# EAGLE design gt-jtx-m32-ver1.0 (EAGLE 7.5.0)
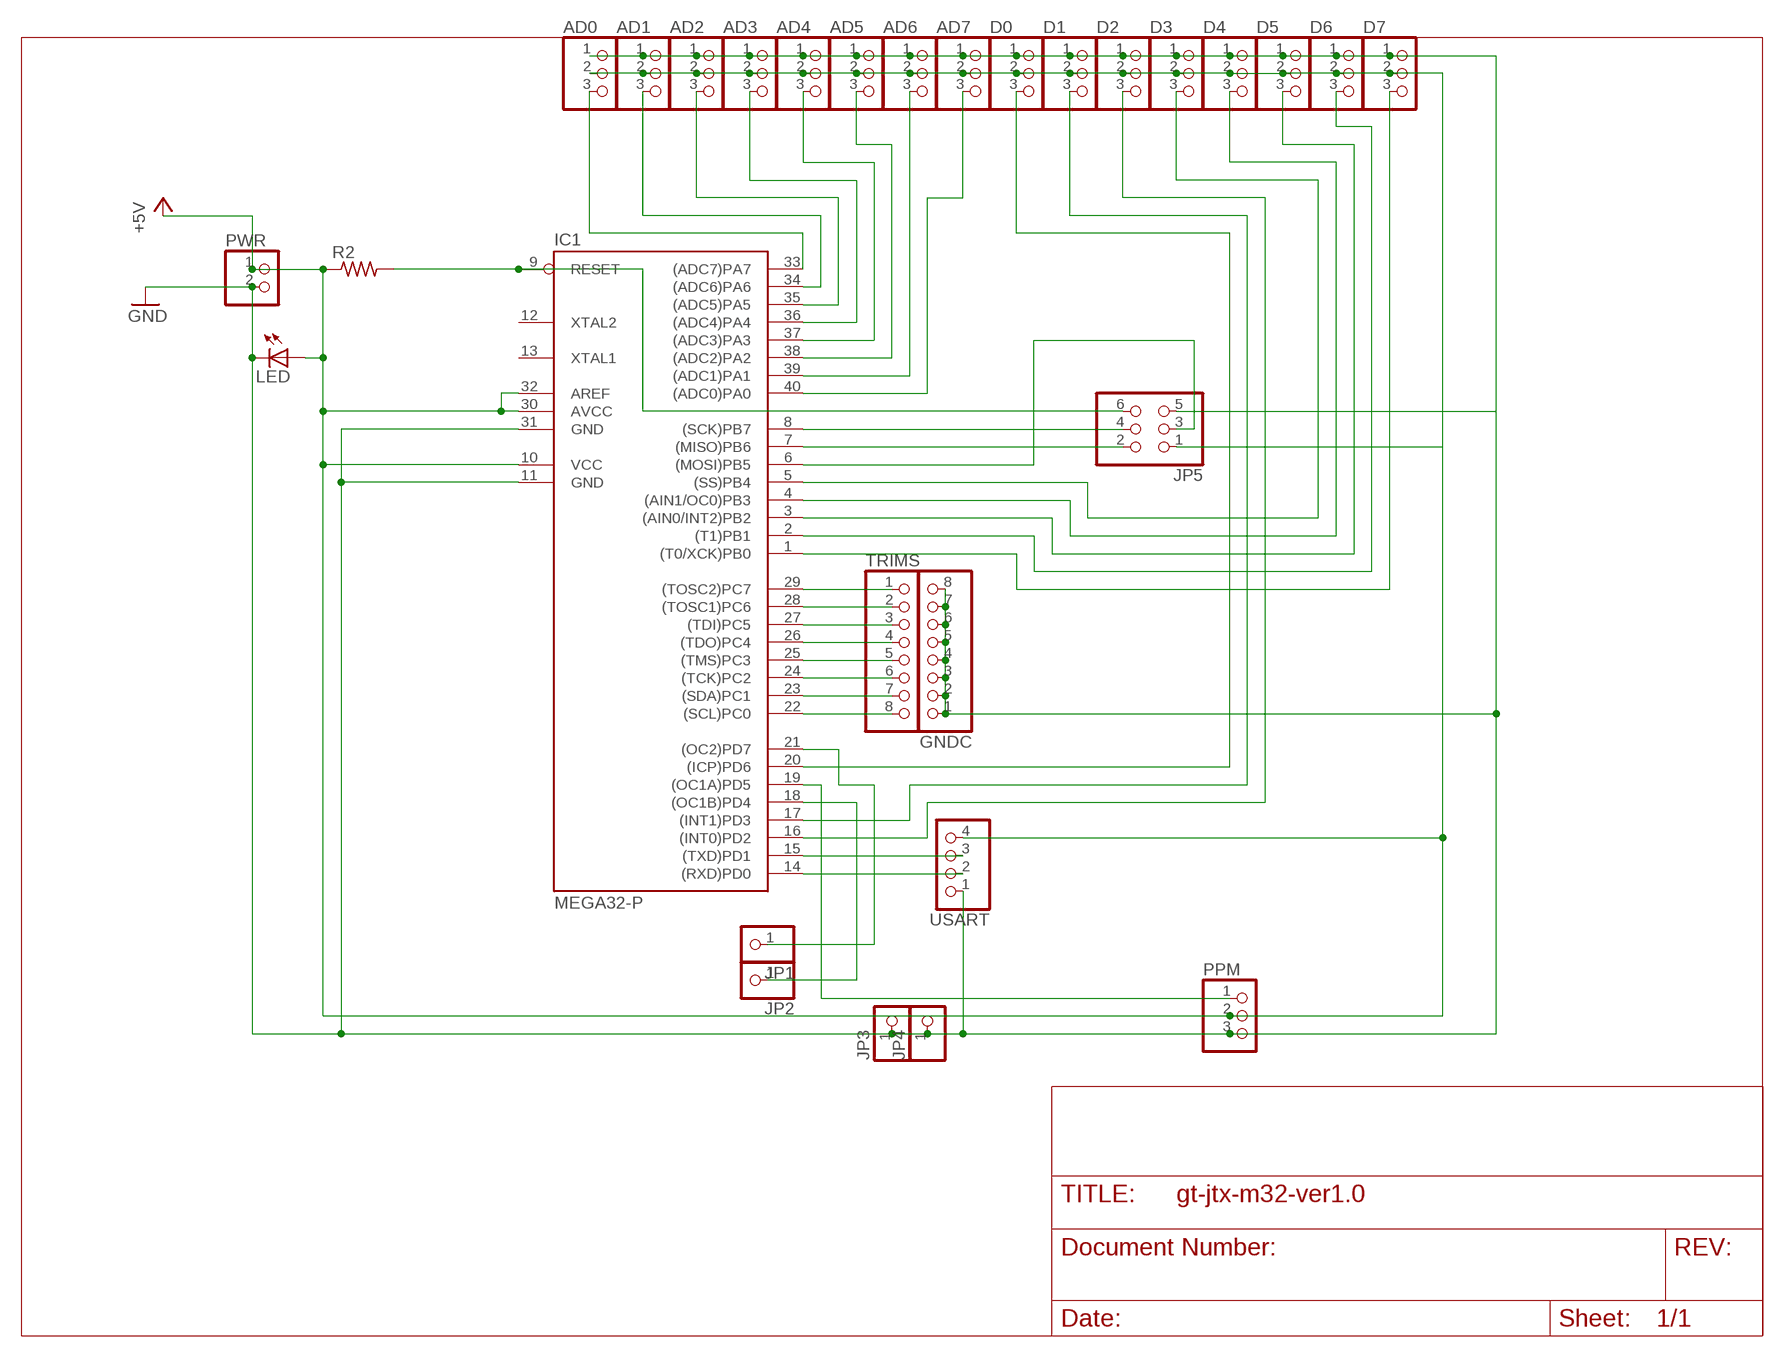
[diagram p0: schematic, sheet 1]

## Parts
AD0  PINHD-1X3  [1X03]
AD1  PINHD-1X3  [1X03]
AD2  PINHD-1X3  [1X03]
AD3  PINHD-1X3  [1X03]
AD4  PINHD-1X3  [1X03]
AD5  PINHD-1X3  [1X03]
AD6  PINHD-1X3  [1X03]
AD7  PINHD-1X3  [1X03]
D0  PINHD-1X3  [1X03]
D1  PINHD-1X3  [1X03]
D2  PINHD-1X3  [1X03]
D3  PINHD-1X3  [1X03]
D4  PINHD-1X3  [1X03]
D5  PINHD-1X3  [1X03]
D6  PINHD-1X3  [1X03]
D7  PINHD-1X3  [1X03]
GNDC  PINHD-1X8  [1X08]
IC1  MEGA32-P  [DIL40]
JP1  PINHD-1X1  [1X01]
JP2  PINHD-1X1  [1X01]
JP3  PINHD-1X1  [1X01]
JP4  PINHD-1X1  [1X01]
JP5  PINHD-2X3  [2X03]
LED  LED5MM  [LED5MM]
PPM  PINHD-1X3  [1X03]
PWR  PINHD-1X2  [1X02]
R2  R-US_0204/2V  [0204V]
TRIMS  PINHD-1X8  [1X08]
USART  PINHD-1X4  [1X04]

## Nets
+5V: AD0.2 AD1.2 AD2.2 AD3.2 AD4.2 AD5.2 AD6.2 AD7.2 D0.2 D1.2 D2.2 D3.2 D4.2 D5.2 D6.2 D7.2 IC1.10(VCC) IC1.30(AVCC) IC1.32(AREF) JP5.1 LED.A PPM.2 PWR.1 R2.1 USART.4
GND: AD0.1 AD1.1 AD2.1 AD3.1 AD4.1 AD5.1 AD6.1 AD7.1 D0.1 D1.1 D2.1 D3.1 D4.1 D5.1 D6.1 D7.1 GNDC.1 GNDC.2 GNDC.3 GNDC.4 GNDC.5 GNDC.6 GNDC.7 GNDC.8 IC1.11(GND) IC1.31(GND) JP3.1 JP4.1 JP5.5 LED.K(C) PPM.3 PWR.2 USART.1
N$1: AD7.3 IC1.40((ADC0)PA0)
N$2: AD6.3 IC1.39((ADC1)PA1)
N$3: AD5.3 IC1.38((ADC2)PA2)
N$4: AD4.3 IC1.37((ADC3)PA3)
N$5: IC1.14((RXD)PD0) USART.2
N$6: IC1.15((TXD)PD1) USART.3
N$7: IC1.29((TOSC2)PC7) TRIMS.1
N$8: AD3.3 IC1.36((ADC4)PA4)
N$9: IC1.9(RESET) JP5.6 R2.2
N$10: AD2.3 IC1.35((ADC5)PA5)
N$11: AD1.3 IC1.34((ADC6)PA6)
N$12: IC1.6((MOSI)PB5) JP5.3
N$13: IC1.7((MISO)PB6) JP5.2
N$14: IC1.8((SCK)PB7) JP5.4
N$15: IC1.19((OC1A)PD5) PPM.1
N$16: IC1.28((TOSC1)PC6) TRIMS.2
N$17: AD0.3 IC1.33((ADC7)PA7)
N$18: IC1.27((TDI)PC5) TRIMS.3
N$19: IC1.26((TDO)PC4) TRIMS.4
N$20: IC1.25((TMS)PC3) TRIMS.5
N$21: IC1.24((TCK)PC2) TRIMS.6
N$22: IC1.23((SDA)PC1) TRIMS.7
N$23: IC1.22((SCL)PC0) TRIMS.8
N$24: D3.3 IC1.5((SS)PB4)
N$25: D4.3 IC1.4((AIN1/OC0)PB3)
N$26: D5.3 IC1.3((AIN0/INT2)PB2)
N$27: D6.3 IC1.2((T1)PB1)
N$28: D7.3 IC1.1((T0/XCK)PB0)
N$29: D2.3 IC1.16((INT0)PD2)
N$30: D1.3 IC1.17((INT1)PD3)
N$31: D0.3 IC1.20((ICP)PD6)
N$32: IC1.18((OC1B)PD4) JP2.1
N$33: IC1.21((OC2)PD7) JP1.1
Unconnected: IC1.12(XTAL2) IC1.13(XTAL1)

## Library data of the parts
AD0 AD1-AD7 D0 D1-D7 PPM = pinhead:PINHD-1X3: PIN HEADER
GNDC TRIMS = pinhead:PINHD-1X8: PIN HEADER
IC1 = atmel:MEGA32-P: MICROCONTROLLER 32 Kbytes FLASH 2 Kbytes SRAM 1 Kbytes EEPROM USART 8-channel 10 bit ADC Source: www.atmel.com .. doc2503.pdf; MPN: ATMEGA32-16PU; OC_FARNELL: 1661729; OC_NEWARK: 51P1794
JP1-JP4 = pinhead:PINHD-1X1: PIN HEADER
JP5 = pinhead:PINHD-2X3: PIN HEADER
LED = led:LED: LED OSRAM: - CHIPLED LG R971, LG N971, LY N971, LG Q971, LY Q971, LO R971, LY R971 LH N974, LH R974 LS Q976, LO Q976, LY Q976 LO Q996 - Hyper CHIPLED LW Q18S LB Q993, LB Q99A, LB R99A - SideLED LS A670, LO A670, LY A670, LG A670, LP A670 LB A673, LV A673, LT A673, LW A673 LH A674 LY A675 LS A676, LA A676, LO A676, LY A676, LW A676 LS A679, LY A679, LG A679 - Hyper Micro SIDELED® LS Y876, LA Y876, LO Y876, LY Y876 LT Y87S - SmartLED LW L88C, LW L88S LB L89C, LB L89S, LG L890 LS L89K, LO L89K, LY L89K LS L896, LA L896, LO L896, LY L896 - TOPLED LS T670, LO T670, LY T670, LG T670, LP T670 LSG T670, LSP T670, LSY T670, LOP T670, LYG T670 LG T671, LOG T671, LSG T671 LB T673, LV T673, LT T673, LW T673 LH T674 LS T676, LA T676, LO T676, LY T676, LB T676, LH T676, LSB T676, LW T676 LB T67C, LV T67C, LT T67C, LS T67K, LO T67K, LY T67K, LW E67C LS E67B, LA E67B, LO E67B, LY E67B, LB E67C, LV E67C, LT E67C LW T67C LS T679, LY T679, LG T679 LS T770, LO T770, LY T770, LG T770, LP T770 LB T773, LV T773, LT T773, LW T773 LH T774 LS E675, LA E675, LY E675, LS T675 LS T776, LA T776, LO T776, LY T776, LB T776 LHGB T686 LT T68C, LB T68C - Hyper Mini TOPLED® LB M676 - Mini TOPLED Santana® LG M470 LS M47K, LO M47K, LY M47K Source: http://www.osram.convergy.de LUXEON: - LUMILED® LXK2-PW12-R00, LXK2-PW12-S00, LXK2-PW14-U00, LXK2-PW14-V00 LXK2-PM12-R00, LXK2-PM12-S00, LXK2-PM14-U00 LXK2-PE12-Q00, LXK2-PE12-R00, LXK2-PE12-S00, LXK2-PE14-T00, LXK2-PE14-U00 LXK2-PB12-K00, LXK2-PB12-L00, LXK2-PB12-M00, LXK2-PB14-N00, LXK2-PB14-P00, LXK2-PB14-Q00 LXK2-PR12-L00, LXK2-PR12-M00, LXK2-PR14-Q00, LXK2-PR14-R00 LXK2-PD12-Q00, LXK2-PD12-R00, LXK2-PD12-S00 LXK2-PH12-R00, LXK2-PH12-S00 LXK2-PL12-P00, LXK2-PL12-Q00, LXK2-PL12-R00 Source: www.luxeon.com KINGBRIGHT: KA-3528ASYC Source: www.kingbright.com
PWR = pinhead:PINHD-1X2: PIN HEADER
R2 = resistor:R-US_: RESISTOR, American symbol
USART = pinhead:PINHD-1X4: PIN HEADER

## Board
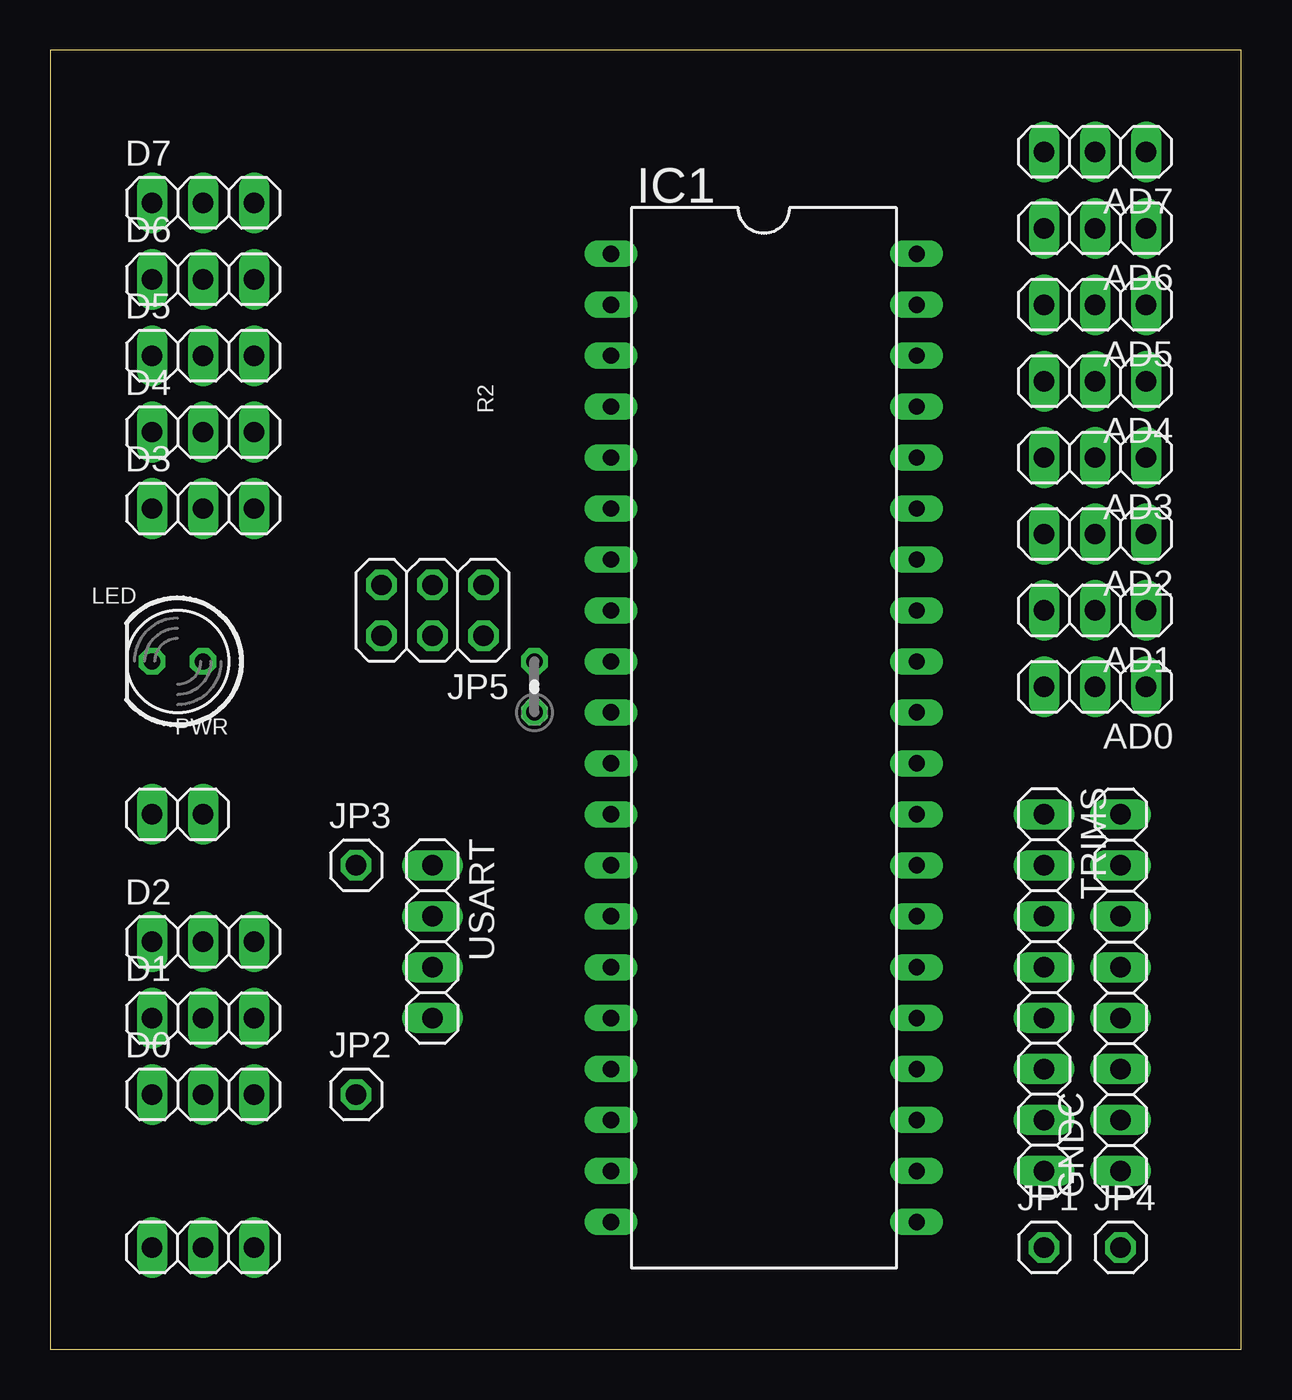
[diagram p1: board, top side]
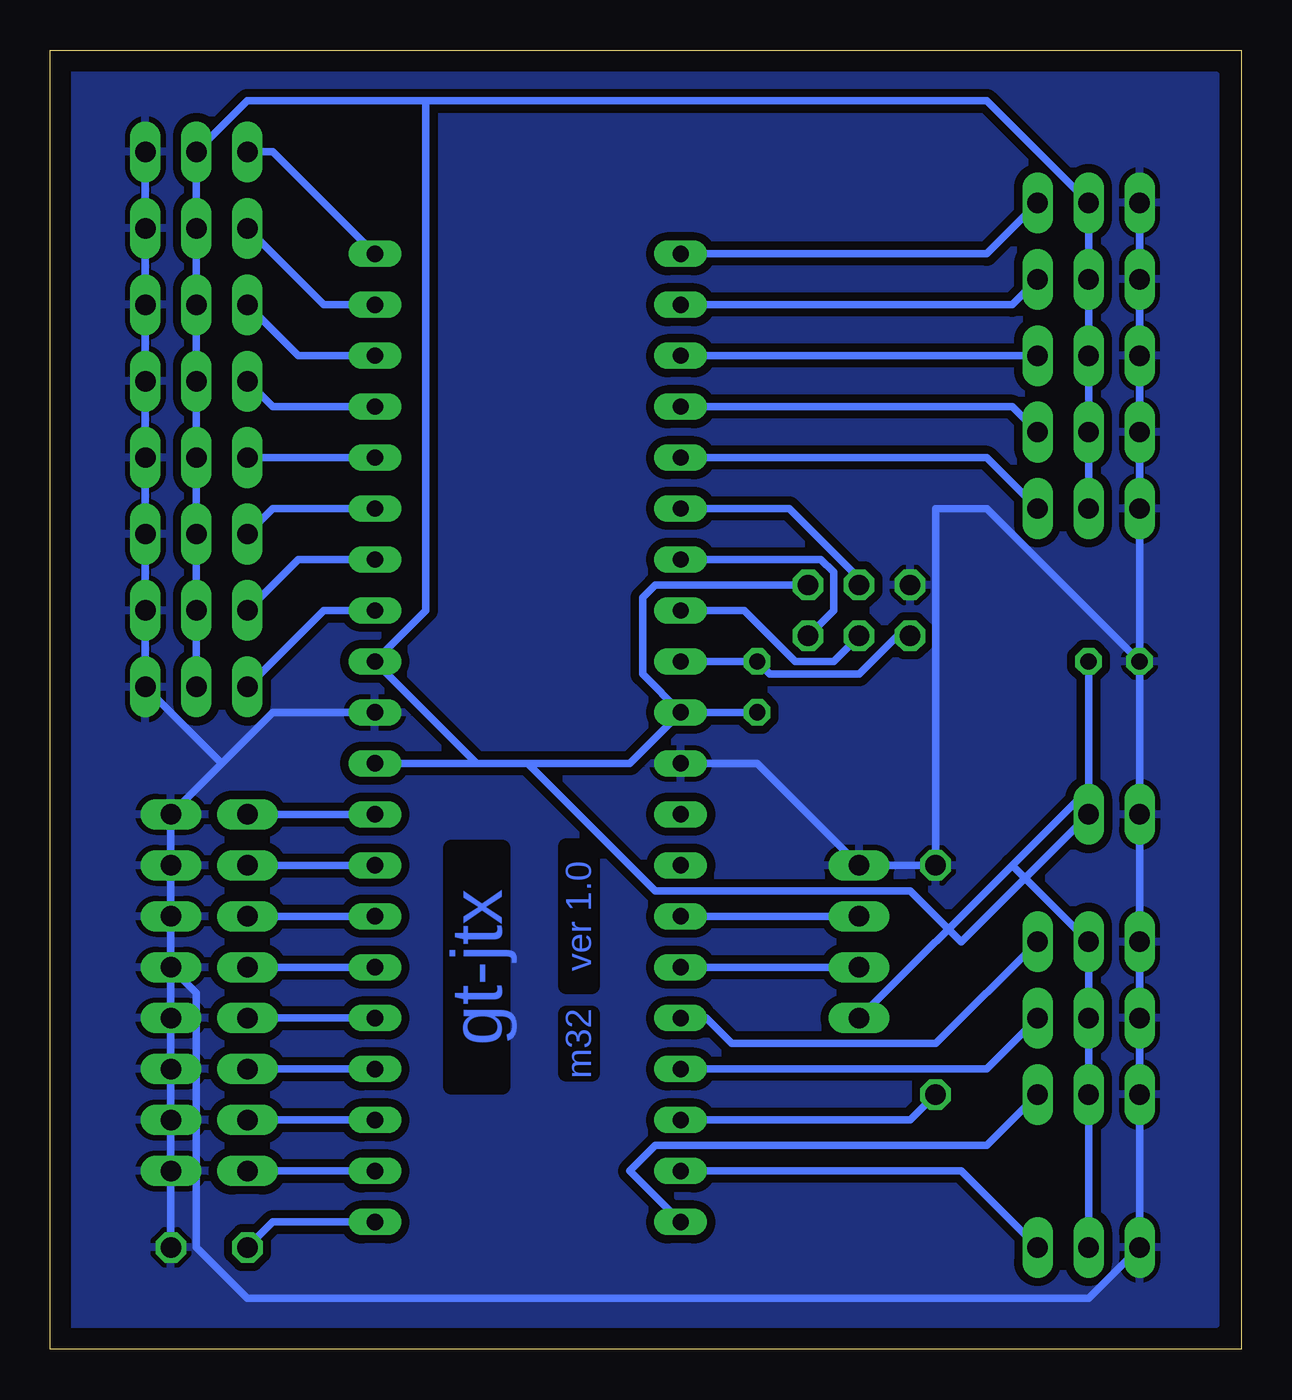
[diagram p2: board, bottom side, seen from below]

Size 59.36 x 64.76 mm. Coordinates in mm from the lower left corner, seen from the top.
Outline: 0,0 59.36,0 59.36,64.76 0,64.76 0,0
Copper layers (1*16): Top 0.035mm / dielectric 1.5mm / Bottom 0.035mm
Design rules "default *": minimum track width 15mil, minimum drill 24mil, track to track 10mil, track to pad 10mil, pad to pad 10mil, via to via 10mil, smd to smd 8mil, copper to edge 40mil, drill to drill 8mil, minimum pad ring 10mil, minimum via ring 8mil, stop-mask expansion 4mil, vias tented up to drill 0mil, thermal gap 10mil

### Footprints (pad centres in the part's own frame; a part is rotated, then mirrored left to right if it is on the bottom)
1X03 = drill 1.016 long: 1 -2.54,0; 2 0,0; 3 2.54,0
1X08 = drill 1.016 long: 1 -8.89,0; 2 -6.35,0; 3 -3.81,0; 4 -1.27,0; 5 1.27,0; 6 3.81,0; 7 6.35,0; 8 8.89,0
DIL40 = drill 0.813 long: 1 -24.13,-7.62; 2 -21.59,-7.62; 3 -19.05,-7.62; 4 -16.51,-7.62; 5 -13.97,-7.62; 6 -11.43,-7.62; 7 -8.89,-7.62; 8 -6.35,-7.62; 9 -3.81,-7.62; 10 -1.27,-7.62; 11 1.27,-7.62; 12 3.81,-7.62; 13 6.35,-7.62; 14 8.89,-7.62; 15 11.43,-7.62; 16 13.97,-7.62; 17 16.51,-7.62; 18 19.05,-7.62; 19 21.59,-7.62; 20 24.13,-7.62; 21 24.13,7.62; 22 21.59,7.62; 23 19.05,7.62; 24 16.51,7.62; 25 13.97,7.62; 26 11.43,7.62; 27 8.89,7.62; 28 6.35,7.62; 29 3.81,7.62; 30 1.27,7.62; 31 -1.27,7.62; 32 -3.81,7.62; 33 -6.35,7.62; 34 -8.89,7.62; 35 -11.43,7.62; 36 -13.97,7.62; 37 -16.51,7.62; 38 -19.05,7.62; 39 -21.59,7.62; 40 -24.13,7.62
1X01 = drill 1.016 octagon: 1 0,0
2X03 = drill 1.016 octagon: 1 -2.54,-1.27; 2 -2.54,1.27; 3 0,-1.27; 4 0,1.27; 5 2.54,-1.27; 6 2.54,1.27
LED5MM = drill 0.813 octagon: A -1.27,0; K 1.27,0
1X02 = drill 1.016 long: 1 -1.27,0; 2 1.27,0
0204V = drill 0.813 octagon: 1 -1.27,0; 2 1.27,0
1X04 = drill 1.016 long: 1 -3.81,0; 2 -1.27,0; 3 1.27,0; 4 3.81,0

### Placement (x,y rotation side)
AD0  52.07,33.02 180 top
AD1  52.07,36.83 180 top
AD2  52.07,40.64 180 top
AD3  52.07,44.45 180 top
AD4  52.07,48.26 180 top
AD5  52.07,52.07 180 top
AD6  52.07,55.88 180 top
AD7  52.07,59.69 180 top
D0  7.62,12.7 0 top
D1  7.62,16.51 0 top
D2  7.62,20.32 0 top
D3  7.62,41.91 0 top
D4  7.62,45.72 0 top
D5  7.62,49.53 0 top
D6  7.62,53.34 0 top
D7  7.62,57.15 0 top
GNDC  53.34,17.78 90 top
IC1  35.56,30.48 270 top
JP1  49.53,5.08 0 top
JP2  15.24,12.7 0 top
JP3  15.24,24.13 0 top
JP4  53.34,5.08 0 top
JP5  19.05,36.83 180 top
LED  6.35,34.29 180 top
PPM  7.62,5.08 180 top
PWR  6.35,26.67 180 top
R2  24.13,33.02 90 top
TRIMS  49.53,17.78 270 top
USART  19.05,20.32 270 top

### Tracks (layer width: path | path; a pad name or v marks a point on that pad's centre or on a via)
+5V
  Bottom 0.381: PPM.2 D0.2 D1.2 D2.2 11.43,24.13 | 7.62,27.94 LED.A | 7.62,27.94 11.43,24.13 | 11.43,24.13 USART.4 | 7.62,27.94 PWR.1 13.97,20.32 16.51,22.86 29.21,22.86 35.56,29.21 | 35.56,29.21 30.48,29.21 IC1.10 | 35.56,29.21 38.1,29.21 | 38.1,29.21 IC1.30 | 38.1,29.21 IC1.32 40.64,36.83 40.64,62.23 | D3.2 D4.2 D5.2 D6.2 D7.2 12.7,62.23 40.64,62.23 | AD0.2 AD1.2 AD2.2 AD3.2 AD4.2 AD5.2 AD6.2 AD7.2 49.53,62.23 40.64,62.23 | IC1.10 R2.1 | JP5.1 29.21,38.1 29.84,37.47 29.84,33.66 IC1.10
GND
  Bottom 0.381: AD7.1 AD6.1 AD5.1 AD4.1 AD3.1 AD2.1 AD1.1 AD0.1 50.8,29.21 | IC1.31 48.26,31.75 50.8,29.21 | 50.8,29.21 GNDC.8 GNDC.7 GNDC.6 GNDC.5 | GNDC.5 GNDC.4 GNDC.3 GNDC.2 GNDC.1 JP4.1 | IC1.11 24.13,29.21 USART.1 JP3.1 15.24,41.91 12.7,41.91 LED.K | D7.1 D6.1 D5.1 D4.1 D3.1 LED.K | LED.K PWR.2 D2.1 D1.1 D0.1 PPM.3 7.62,2.54 49.53,2.54 52.07,5.08 52.07,17.78 GNDC.5
  pour Bottom (isolate 0.406): 1.27,63.5 58.42,63.5 58.42,1.27 1.27,1.27
N$1
  Bottom 0.381: IC1.40 48.26,59.69 AD7.3
N$2
  Bottom 0.381: IC1.39 45.72,52.07 AD6.3
N$3
  Bottom 0.381: IC1.38 46.99,49.53 AD5.3
N$4
  Bottom 0.381: IC1.37 48.26,46.99 AD4.3
N$5
  Bottom 0.381: USART.2 IC1.14
N$6
  Bottom 0.381: USART.3 IC1.15
N$7
  Bottom 0.381: TRIMS.1 IC1.29
N$8
  Bottom 0.381: AD3.3 IC1.36
N$9
  Bottom 0.381: IC1.9 R2.2 23.5,33.66 19.05,33.66 17.14,35.56 JP5.6
N$10
  Bottom 0.381: IC1.35 48.26,41.91 AD2.3
N$11
  Bottom 0.381: IC1.34 46.99,39.37 AD1.3
N$12
  Bottom 0.381: IC1.6 22.54,41.91 19.05,38.42 JP5.3
N$13
  Bottom 0.381: IC1.7 20.95,39.37 20.32,38.73 20.32,36.83 JP5.2
N$14
  Bottom 0.381: IC1.8 24.77,36.83 22.23,34.29 20.32,34.29 JP5.4
N$15
  Bottom 0.381: IC1.19 13.97,8.89 PPM.1
N$16
  Bottom 0.381: TRIMS.2 IC1.28
N$17
  Bottom 0.381: IC1.33 45.72,36.83 AD0.3
N$18
  Bottom 0.381: TRIMS.3 IC1.27
N$19
  Bottom 0.381: TRIMS.4 IC1.26
N$20
  Bottom 0.381: TRIMS.5 IC1.25
N$21
  Bottom 0.381: TRIMS.6 IC1.24
N$22
  Bottom 0.381: TRIMS.7 IC1.23
N$23
  Bottom 0.381: TRIMS.8 IC1.22
N$24
  Bottom 0.381: IC1.5 12.7,44.45 D3.3
N$25
  Bottom 0.381: IC1.4 11.43,46.99 D4.3
N$26
  Bottom 0.381: D5.3 IC1.3
N$27
  Bottom 0.381: IC1.2 11.43,52.07 D6.3
N$28
  Bottom 0.381: IC1.1 12.7,54.61 D7.3
N$29
  Bottom 0.381: IC1.16 26.67,16.51 25.4,15.24 15.24,15.24 D2.3
N$30
  Bottom 0.381: IC1.17 12.7,13.97 D1.3
N$31
  Bottom 0.381: IC1.20 30.48,8.89 29.21,10.16 12.7,10.16 D0.3
N$32
  Bottom 0.381: IC1.18 16.51,11.43 JP2.1
N$33
  Bottom 0.381: IC1.21 48.26,6.35 JP1.1

### Text on the board
Bottom: ver 1.0 | gt-jtx | m32